# Altium schematic sheet Sheet.SchDoc
size A2
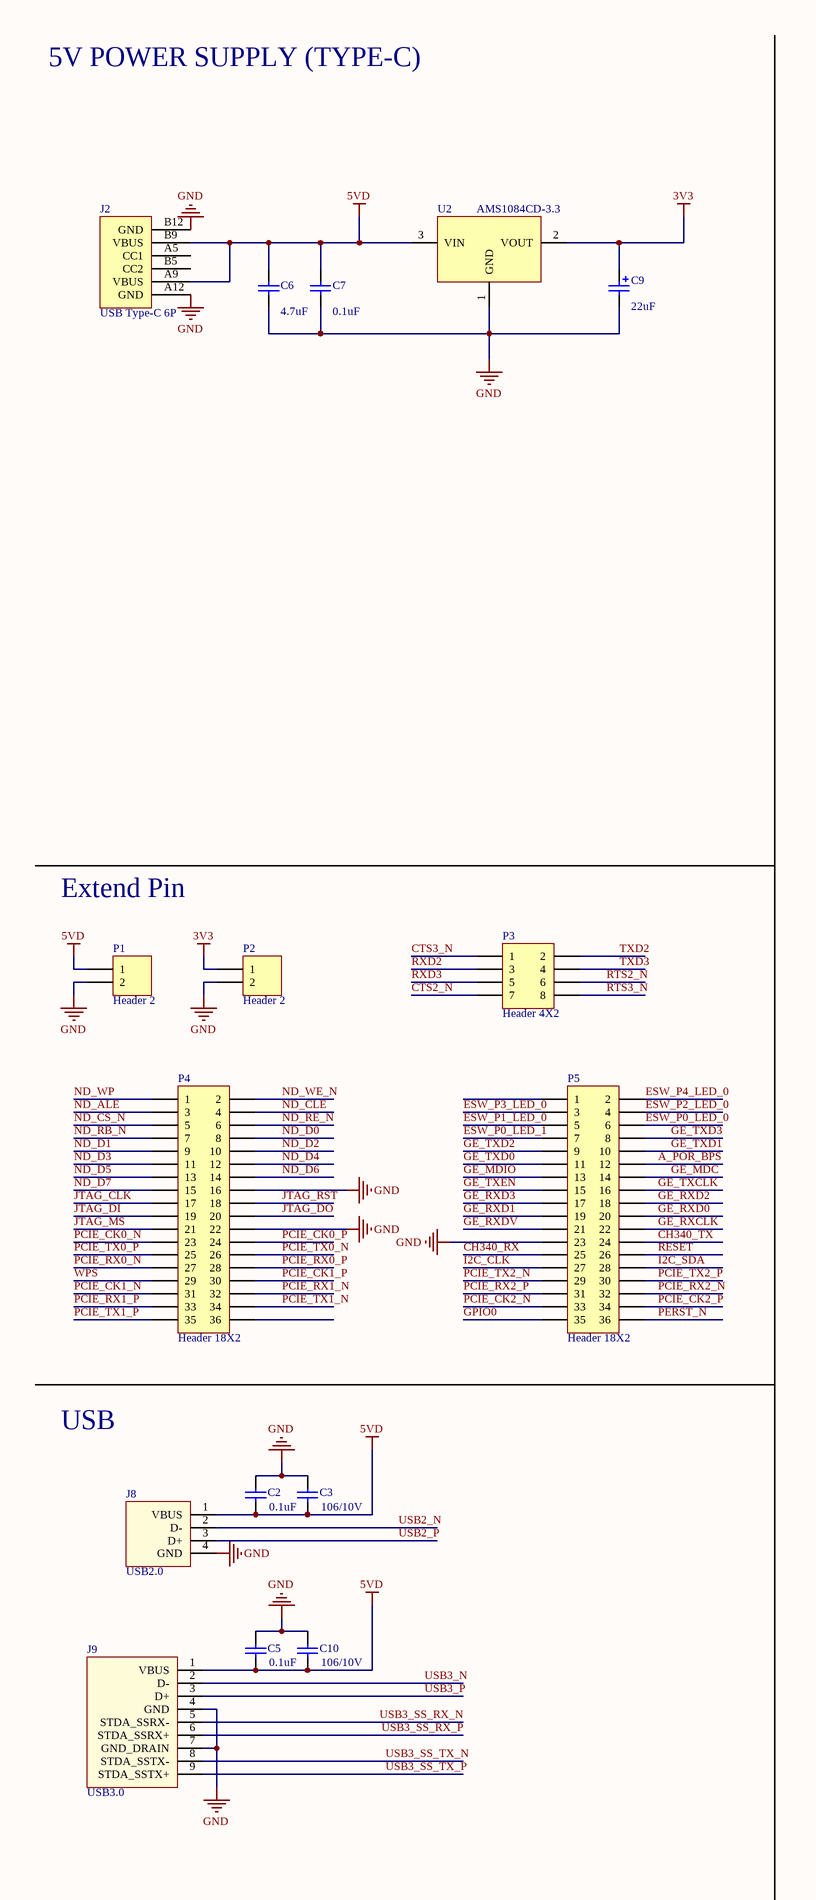
[diagram p0: Sheet.SchDoc, left]
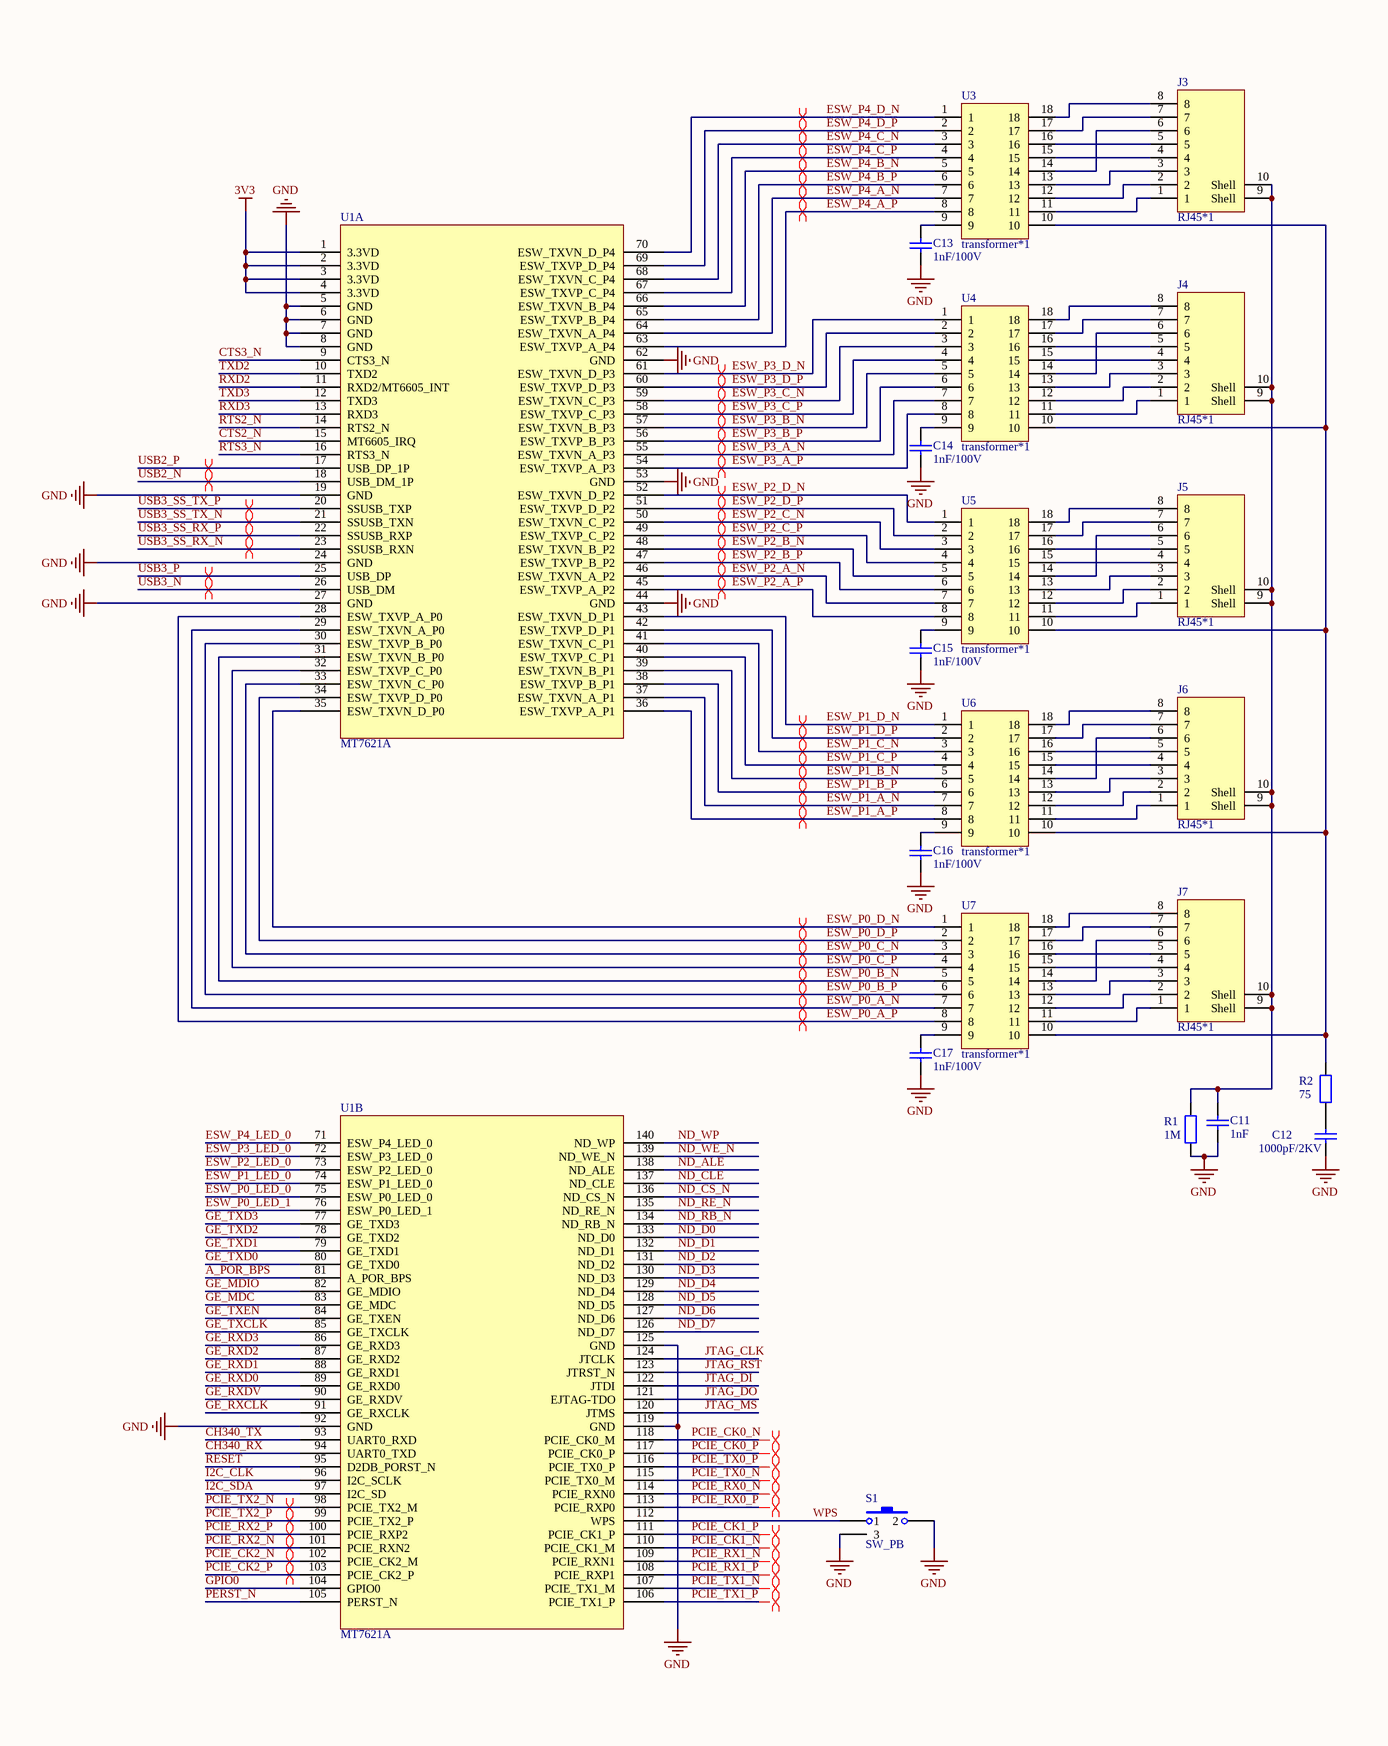
[diagram p1: Sheet.SchDoc, right]

## Parts
C2  value 0.1uF  [6-0805]  (hidden comment: Cap)
C3  value 106/10V  [6-0805]  (hidden comment: Cap)
C5  value 0.1uF  [6-0805]  (hidden comment: Cap)
C6  value 4.7uF  [6-0805]  (hidden comment: Cap)
C7  value 0.1uF  [6-0805]  (hidden comment: Cap)
C9  value 22uF  [3528B]  (hidden comment: Cap Pol2)
C10  value 106/10V  [6-0805]  (hidden comment: Cap)
C11  value 1nF  [8-1206]  (hidden comment: Cap)
C12  value 1000pF/2KV  [8-1206]  (hidden comment: Cap)
C13  value 1nF/100V  [6-0805]  (hidden comment: Cap)
C14  value 1nF/100V  [6-0805]  (hidden comment: Cap)
C15  value 1nF/100V  [6-0805]  (hidden comment: Cap)
C16  value 1nF/100V  [6-0805]  (hidden comment: Cap)
C17  value 1nF/100V  [6-0805]  (hidden comment: Cap)
J2  USB Type-C 6P  [USB Type-C 6P]
J3  RJ45*1
J4  RJ45*1
J5  RJ45*1
J6  RJ45*1
J7  RJ45*1
J8  USB2.0  [USB2.0]
J9  USB3.0  [USB3.0_0]
P1  Header 2  [HDR1X2]
P2  Header 2  [HDR1X2]
P3  Header 4X2  [HDR2X4]
P4  Header 18X2  [HDR2X18]
P5  Header 18X2  [HDR2X18]
R1  value 1M  [8-1206]  (hidden comment: Res2)
R2  value 75  [8-1206]  (hidden comment: Res2)
S1  SW_PB  [SW_PB]
U1  MT7621A  [HLK-7621]  (parts A,B of 2)
U2  AMS1084CD-3.3  [TO252]
U3  transformer*1  [transformer_G1801D]
U4  transformer*1  [transformer_G1801D]
U5  transformer*1  [transformer_G1801D]
U6  transformer*1  [transformer_G1801D]
U7  transformer*1  [transformer_G1801D]

## Nets
3V3: C9.1 P2.1 U1.1(3.3VD) U1.2(3.3VD) U1.3(3.3VD) U1.4(3.3VD) U2.2(VOUT)
5VD: C2.1 C3.1 C5.1 C6.2 C7.2 C10.1 J2.A9(VBUS) J2.B9(VBUS) J8.1(VBUS) J9.1(VBUS) P1.1 U2.3(VIN)
GND: C2.2 C3.2 C5.2 C6.1 C7.1 C9.2 C10.2 C11.1 C12.2 C13.2 C14.2 C15.2 C16.2 C17.2 J2.A12(GND) J2.B12(GND) J8.4(GND) J9.4(GND) J9.7(GND_DRAIN) P1.2 P2.2 P4.16 P4.22 P5.23 R1.1 S1.2 S1.3 U1.5(GND) U1.6(GND) U1.7(GND) U1.8(GND) U1.19(GND) U1.24(GND) U1.27(GND) U1.44(GND) U1.53(GND) U1.62(GND) U1.92(GND) U1.119(GND) U1.125(GND) U2.1(GND)
A_POR_BPS: P5.12 U1.81(A_POR_BPS)
CH340_RX: P5.25 U1.94(UART0_TXD)
CH340_TX: P5.24 U1.93(UART0_RXD)
CTS2_N: P3.7 U1.15(MT6605_IRQ)
CTS3_N: P3.1 U1.9(CTS3_N)
ESW_P0_A_N: U1.29(ESW_TXVN_A_P0) U7.7
ESW_P0_A_P: U1.28(ESW_TXVP_A_P0) U7.8
ESW_P0_B_N: U1.31(ESW_TXVN_B_P0) U7.5
ESW_P0_B_P: U1.30(ESW_TXVP_B_P0) U7.6
ESW_P0_C_N: U1.33(ESW_TXVN_C_P0) U7.3
ESW_P0_C_P: U1.32(ESW_TXVP_C_P0) U7.4
ESW_P0_D_N: U1.35(ESW_TXVN_D_P0) U7.1
ESW_P0_D_P: U1.34(ESW_TXVP_D_P0) U7.2
ESW_P0_LED_0: P5.6 U1.75(ESW_P0_LED_0)
ESW_P0_LED_1: P5.7 U1.76(ESW_P0_LED_1)
ESW_P1_A_N: U1.37(ESW_TXVN_A_P1) U6.7
ESW_P1_A_P: U1.36(ESW_TXVP_A_P1) U6.8
ESW_P1_B_N: U1.39(ESW_TXVN_B_P1) U6.5
ESW_P1_B_P: U1.38(ESW_TXVP_B_P1) U6.6
ESW_P1_C_N: U1.41(ESW_TXVN_C_P1) U6.3
ESW_P1_C_P: U1.40(ESW_TXVP_C_P1) U6.4
ESW_P1_D_N: U1.43(ESW_TXVN_D_P1) U6.1
ESW_P1_D_P: U1.42(ESW_TXVP_D_P1) U6.2
ESW_P1_LED_0: P5.5 U1.74(ESW_P1_LED_0)
ESW_P2_A_N: U1.46(ESW_TXVN_A_P2) U5.7
ESW_P2_A_P: U1.45(ESW_TXVP_A_P2) U5.8
ESW_P2_B_N: U1.48(ESW_TXVN_B_P2) U5.5
ESW_P2_B_P: U1.47(ESW_TXVP_B_P2) U5.6
ESW_P2_C_N: U1.50(ESW_TXVN_C_P2) U5.3
ESW_P2_C_P: U1.49(ESW_TXVP_C_P2) U5.4
ESW_P2_D_N: U1.52(ESW_TXVN_D_P2) U5.1
ESW_P2_D_P: U1.51(ESW_TXVP_D_P2) U5.2
ESW_P2_LED_0: P5.4 U1.73(ESW_P2_LED_0)
ESW_P3_A_N: U1.55(ESW_TXVN_A_P3) U4.7
ESW_P3_A_P: U1.54(ESW_TXVP_A_P3) U4.8
ESW_P3_B_N: U1.57(ESW_TXVN_B_P3) U4.5
ESW_P3_B_P: U1.56(ESW_TXVP_B_P3) U4.6
ESW_P3_C_N: U1.59(ESW_TXVN_C_P3) U4.3
ESW_P3_C_P: U1.58(ESW_TXVP_C_P3) U4.4
ESW_P3_D_N: U1.61(ESW_TXVN_D_P3) U4.1
ESW_P3_D_P: U1.60(ESW_TXVP_D_P3) U4.2
ESW_P3_LED_0: P5.3 U1.72(ESW_P3_LED_0)
ESW_P4_A_N: U1.64(ESW_TXVN_A_P4) U3.7
ESW_P4_A_P: U1.63(ESW_TXVP_A_P4) U3.8
ESW_P4_B_N: U1.66(ESW_TXVN_B_P4) U3.5
ESW_P4_B_P: U1.65(ESW_TXVP_B_P4) U3.6
ESW_P4_C_N: U1.68(ESW_TXVN_C_P4) U3.3
ESW_P4_C_P: U1.67(ESW_TXVP_C_P4) U3.4
ESW_P4_D_N: U1.70(ESW_TXVN_D_P4) U3.1
ESW_P4_D_P: U1.69(ESW_TXVP_D_P4) U3.2
ESW_P4_LED_0: P5.2 U1.71(ESW_P4_LED_0)
GE_MDC: P5.14 U1.83(GE_MDC)
GE_MDIO: P5.13 U1.82(GE_MDIO)
GE_RXCLK: P5.22 U1.91(GE_RXCLK)
GE_RXD0: P5.20 U1.89(GE_RXD0)
GE_RXD1: P5.19 U1.88(GE_RXD1)
GE_RXD2: P5.18 U1.87(GE_RXD2)
GE_RXD3: P5.17 U1.86(GE_RXD3)
GE_RXDV: P5.21 U1.90(GE_RXDV)
GE_TXCLK: P5.16 U1.85(GE_TXCLK)
GE_TXD0: P5.11 U1.80(GE_TXD0)
GE_TXD1: P5.10 U1.79(GE_TXD1)
GE_TXD2: P5.9 U1.78(GE_TXD2)
GE_TXD3: P5.8 U1.77(GE_TXD3)
GE_TXEN: P5.15 U1.84(GE_TXEN)
GPIO0: P5.35 U1.104(GPIO0)
I2C_CLK: P5.27 U1.96(I2C_SCLK)
I2C_SDA: P5.28 U1.97(I2C_SD)
JTAG_CLK: P4.17 U1.124(JTCLK)
JTAG_DI: P4.19 U1.122(JTDI)
JTAG_DO: P4.20 U1.121(EJTAG-TDO)
JTAG_MS: P4.21 U1.120(JTMS)
JTAG_RST: P4.18 U1.123(JTRST_N)
ND_ALE: P4.3 U1.138(ND_ALE)
ND_CLE: P4.4 U1.137(ND_CLE)
ND_CS_N: P4.5 U1.136(ND_CS_N)
ND_D0: P4.8 U1.133(ND_D0)
ND_D1: P4.9 U1.132(ND_D1)
ND_D2: P4.10 U1.131(ND_D2)
ND_D3: P4.11 U1.130(ND_D3)
ND_D4: P4.12 U1.129(ND_D4)
ND_D5: P4.13 U1.128(ND_D5)
ND_D6: P4.14 U1.127(ND_D6)
ND_D7: P4.15 U1.126(ND_D7)
ND_RB_N: P4.7 U1.134(ND_RB_N)
ND_RE_N: P4.6 U1.135(ND_RE_N)
ND_WE_N: P4.2 U1.139(ND_WE_N)
ND_WP: P4.1 U1.140(ND_WP)
PCIE_CK0_N: P4.23 U1.118(PCIE_CK0_M)
PCIE_CK0_P: P4.24 U1.117(PCIE_CK0_P)
PCIE_CK1_N: P4.31 U1.110(PCIE_CK1_M)
PCIE_CK1_P: P4.30 U1.111(PCIE_CK1_P)
PCIE_CK2_N: P5.33 U1.102(PCIE_CK2_M)
PCIE_CK2_P: P5.34 U1.103(PCIE_CK2_P)
PCIE_RX0_N: P4.27 U1.114(PCIE_RXN0)
PCIE_RX0_P: P4.28 U1.113(PCIE_RXP0)
PCIE_RX1_N: P4.32 U1.109(PCIE_RXN1)
PCIE_RX1_P: P4.33 U1.108(PCIE_RXP1)
PCIE_RX2_N: P5.32 U1.101(PCIE_RXN2)
PCIE_RX2_P: P5.31 U1.100(PCIE_RXP2)
PCIE_TX0_N: P4.26 U1.115(PCIE_TX0_M)
PCIE_TX0_P: P4.25 U1.116(PCIE_TX0_P)
PCIE_TX1_N: P4.34 U1.107(PCIE_TX1_M)
PCIE_TX1_P: P4.35 U1.106(PCIE_TX1_P)
PCIE_TX2_N: P5.29 U1.98(PCIE_TX2_M)
PCIE_TX2_P: P5.30 U1.99(PCIE_TX2_P)
PERST_N: P5.36 U1.105(PERST_N)
RESET: P5.26 U1.95(D2DB_PORST_N)
RTS2_N: P3.6 U1.14(RTS2_N)
RTS3_N: P3.8 U1.16(RTS3_N)
RXD2: P3.3 U1.11(RXD2/MT6605_INT)
RXD3: P3.5 U1.13(RXD3)
TXD2: P3.2 U1.10(TXD2)
TXD3: P3.4 U1.12(TXD3)
USB2_N: J8.2(D-) U1.18(USB_DM_1P)
USB2_P: J8.3(D+) U1.17(USB_DP_1P)
USB3_N: J9.2(D-) U1.26(USB_DM)
USB3_P: J9.3(D+) U1.25(USB_DP)
USB3_SS_RX_N: J9.5(STDA_SSRX-) U1.23(SSUSB_RXN)
USB3_SS_RX_P: J9.6(STDA_SSRX+) U1.22(SSUSB_RXP)
USB3_SS_TX_N: J9.8(STDA_SSTX-) U1.21(SSUSB_TXN)
USB3_SS_TX_P: J9.9(STDA_SSTX+) U1.20(SSUSB_TXP)
WPS: P4.29 S1.1 U1.112(WPS)
NetC11_2: C11.2 J3.9(Shell) J3.10(Shell) J4.9(Shell) J4.10(Shell) J5.9(Shell) J5.10(Shell) J6.9(Shell) J6.10(Shell) J7.9(Shell) J7.10(Shell) R1.2
NetC12_1: C12.1 R2.1
NetC13_1: C13.1 U3.9
NetC14_1: C14.1 U4.9
NetC15_1: C15.1 U5.9
NetC16_1: C16.1 U6.9
NetC17_1: C17.1 U7.9
NetJ3_1: J3.1 U3.11
NetJ3_2: J3.2 U3.12
NetJ3_3: J3.3 U3.13
NetJ3_4: J3.4 U3.15
NetJ3_5: J3.5 U3.16
NetJ3_6: J3.6 U3.14
NetJ3_7: J3.7 U3.17
NetJ3_8: J3.8 U3.18
NetJ4_1: J4.1 U4.11
NetJ4_2: J4.2 U4.12
NetJ4_3: J4.3 U4.13
NetJ4_4: J4.4 U4.15
NetJ4_5: J4.5 U4.16
NetJ4_6: J4.6 U4.14
NetJ4_7: J4.7 U4.17
NetJ4_8: J4.8 U4.18
NetJ5_1: J5.1 U5.11
NetJ5_2: J5.2 U5.12
NetJ5_3: J5.3 U5.13
NetJ5_4: J5.4 U5.15
NetJ5_5: J5.5 U5.16
NetJ5_6: J5.6 U5.14
NetJ5_7: J5.7 U5.17
NetJ5_8: J5.8 U5.18
NetJ6_1: J6.1 U6.11
NetJ6_2: J6.2 U6.12
NetJ6_3: J6.3 U6.13
NetJ6_4: J6.4 U6.15
NetJ6_5: J6.5 U6.16
NetJ6_6: J6.6 U6.14
NetJ6_7: J6.7 U6.17
NetJ6_8: J6.8 U6.18
NetJ7_1: J7.1 U7.11
NetJ7_2: J7.2 U7.12
NetJ7_3: J7.3 U7.13
NetJ7_4: J7.4 U7.15
NetJ7_5: J7.5 U7.16
NetJ7_6: J7.6 U7.14
NetJ7_7: J7.7 U7.17
NetJ7_8: J7.8 U7.18
NetR2_2: R2.2 U3.10 U4.10 U5.10 U6.10 U7.10

Not connected (* = marked no-connect by the designer): J2 A5(CC1) B5(CC2); P4 36; P5 1

## Layout directives
differential pair: ESW_P0_A_N, ESW_P0_A_P, ESW_P0_B_N, ESW_P0_B_P, ESW_P0_C_N, ESW_P0_C_P, ESW_P0_D_N, ESW_P0_D_P, ESW_P1_A_N, ESW_P1_A_P, ESW_P1_B_N, ESW_P1_B_P, ESW_P1_C_N, ESW_P1_C_P, ESW_P1_D_N, ESW_P1_D_P, ESW_P2_A_N, ESW_P2_A_P, ESW_P2_B_N, ESW_P2_B_P, ESW_P2_C_N, ESW_P2_C_P, ESW_P2_D_N, ESW_P2_D_P, ESW_P3_A_N, ESW_P3_A_P, ESW_P3_B_N, ESW_P3_B_P, ESW_P3_C_N, ESW_P3_C_P, ESW_P3_D_N, ESW_P3_D_P, ESW_P4_A_N, ESW_P4_A_P, ESW_P4_B_N, ESW_P4_B_P, ESW_P4_C_N, ESW_P4_C_P, ESW_P4_D_N, ESW_P4_D_P, PCIE_CK0_N, PCIE_CK0_P, PCIE_CK1_N, PCIE_CK1_P, PCIE_CK2_N, PCIE_CK2_P, PCIE_RX0_N, PCIE_RX0_P, PCIE_RX1_N, PCIE_RX1_P, PCIE_RX2_N, PCIE_RX2_P, PCIE_TX0_N, PCIE_TX0_P, PCIE_TX1_N, PCIE_TX1_P, PCIE_TX2_N, PCIE_TX2_P, USB2_N, USB2_P, USB3_N, USB3_P, USB3_SS_RX_N, USB3_SS_RX_P, USB3_SS_TX_N, USB3_SS_TX_P

## Notes on the sheet
- 5V POWER SUPPLY (TYPE-C)
- Extend Pin
- USB

## Library data of the parts
C2 C3 C5-C7 C10-C17 = Cap: Capacitor; Published: 8-Jun-2000; LatestRevisionDate: 17-Jul-2002; LatestRevisionNote: Re-released for DXP Platform.; PackageReference: RAD-0.3; Publisher: Altium Limited; PackageDescription: Radial Cap, Thru-Hole; 2 Leads; 0.3 in Pin Spacing
C9 = Cap Pol2: Polarized Capacitor (Axial); Published: 8-Jun-2000; LatestRevisionDate: 17-Jul-2002; LatestRevisionNote: Re-released for DXP Platform.; PackageReference: POLAR0.8; Publisher: Altium Limited; PackageDescription: Polarized Capacitor; 2 Leads
P1 P2 = Header 2: Header, 2-Pin; LatestRevisionDate: 17-Jul-2002; LatestRevisionNote: Re-released for DXP Platform.; Publisher: Altium Limited
P3 = Header 4X2: Header, 4-Pin, Dual row; LatestRevisionDate: 17-Jul-2002; LatestRevisionNote: Re-released for DXP Platform.; Publisher: Altium Limited
P4 P5 = Header 18X2: Header, 18-Pin, Dual row; LatestRevisionDate: 17-Jul-2002; LatestRevisionNote: Re-released for DXP Platform.; Publisher: Altium Limited
R1 R2 = Res2: Resistor; Published: 8-Jun-2000; LatestRevisionDate: 17-Jul-2002; LatestRevisionNote: Re-released for DXP Platform.; PackageReference: AXIAL-0.4; Publisher: Altium Limited; PackageDescription: Axial Device, Thru-Hole; 2 Leads; 0.4 in Pin Spacing